# Altium project PCB_PROJECT2.PRJPCB
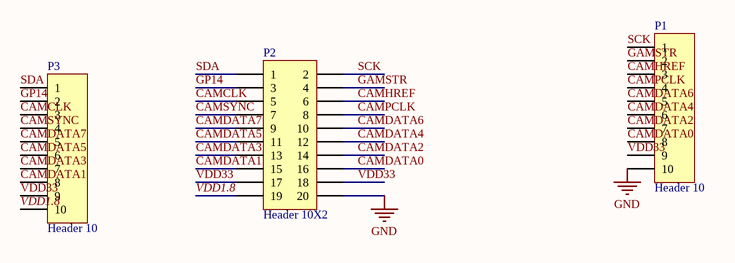
[diagram p0: Sheet1.SchDoc]
1 sheet, 3 parts. Net scope: global (net labels, ports and power ports of the same name join across sheets).
Board file: PCB1.PcbDoc

## Sheet Sheet1.SchDoc
size A4

### Parts
P1  Header 10  [HDR1X10]
P2  Header 10X2  [H20X1 2.0]
P3  Header 10  [HDR1X10]

### Nets
GND: P1.10 P2.20
CAMCLK: P2.5 P3.3
CAMDATA0: P1.8 P2.16
CAMDATA1: P2.15 P3.8
CAMDATA2: P1.7 P2.14
CAMDATA3: P2.13 P3.7
CAMDATA4: P1.6 P2.12
CAMDATA5: P2.11 P3.6
CAMDATA6: P1.5 P2.10
CAMDATA7: P2.9 P3.5
CAMHREF: P1.3 P2.6
CAMPCLK: P1.4 P2.8
CAMSYNC: P2.7 P3.4
GAMSTR: P1.2 P2.4
GP14: P2.3 P3.2
SCK: P1.1 P2.2
SDA: P2.1 P3.1
VDD1.8: P2.19 P3.10
VDD33: P1.9 P2.17 P2.18 P3.9

### Library data of the parts
P1 P3 = Header 10: Header, 10-Pin; LatestRevisionDate: 17-Jul-2002; LatestRevisionNote: Re-released for DXP Platform.; Publisher: Altium Limited
P2 = Header 10X2: Header, 10-Pin, Dual row; LatestRevisionDate: 17-Jul-2002; LatestRevisionNote: Re-released for DXP Platform.; Publisher: Altium Limited